# EAGLE design mailbox (EAGLE 7.5.0)
CNAME: MiniElektro Denmark; CREVISION: 0 #1620; DESIGNER: By: NWYKE
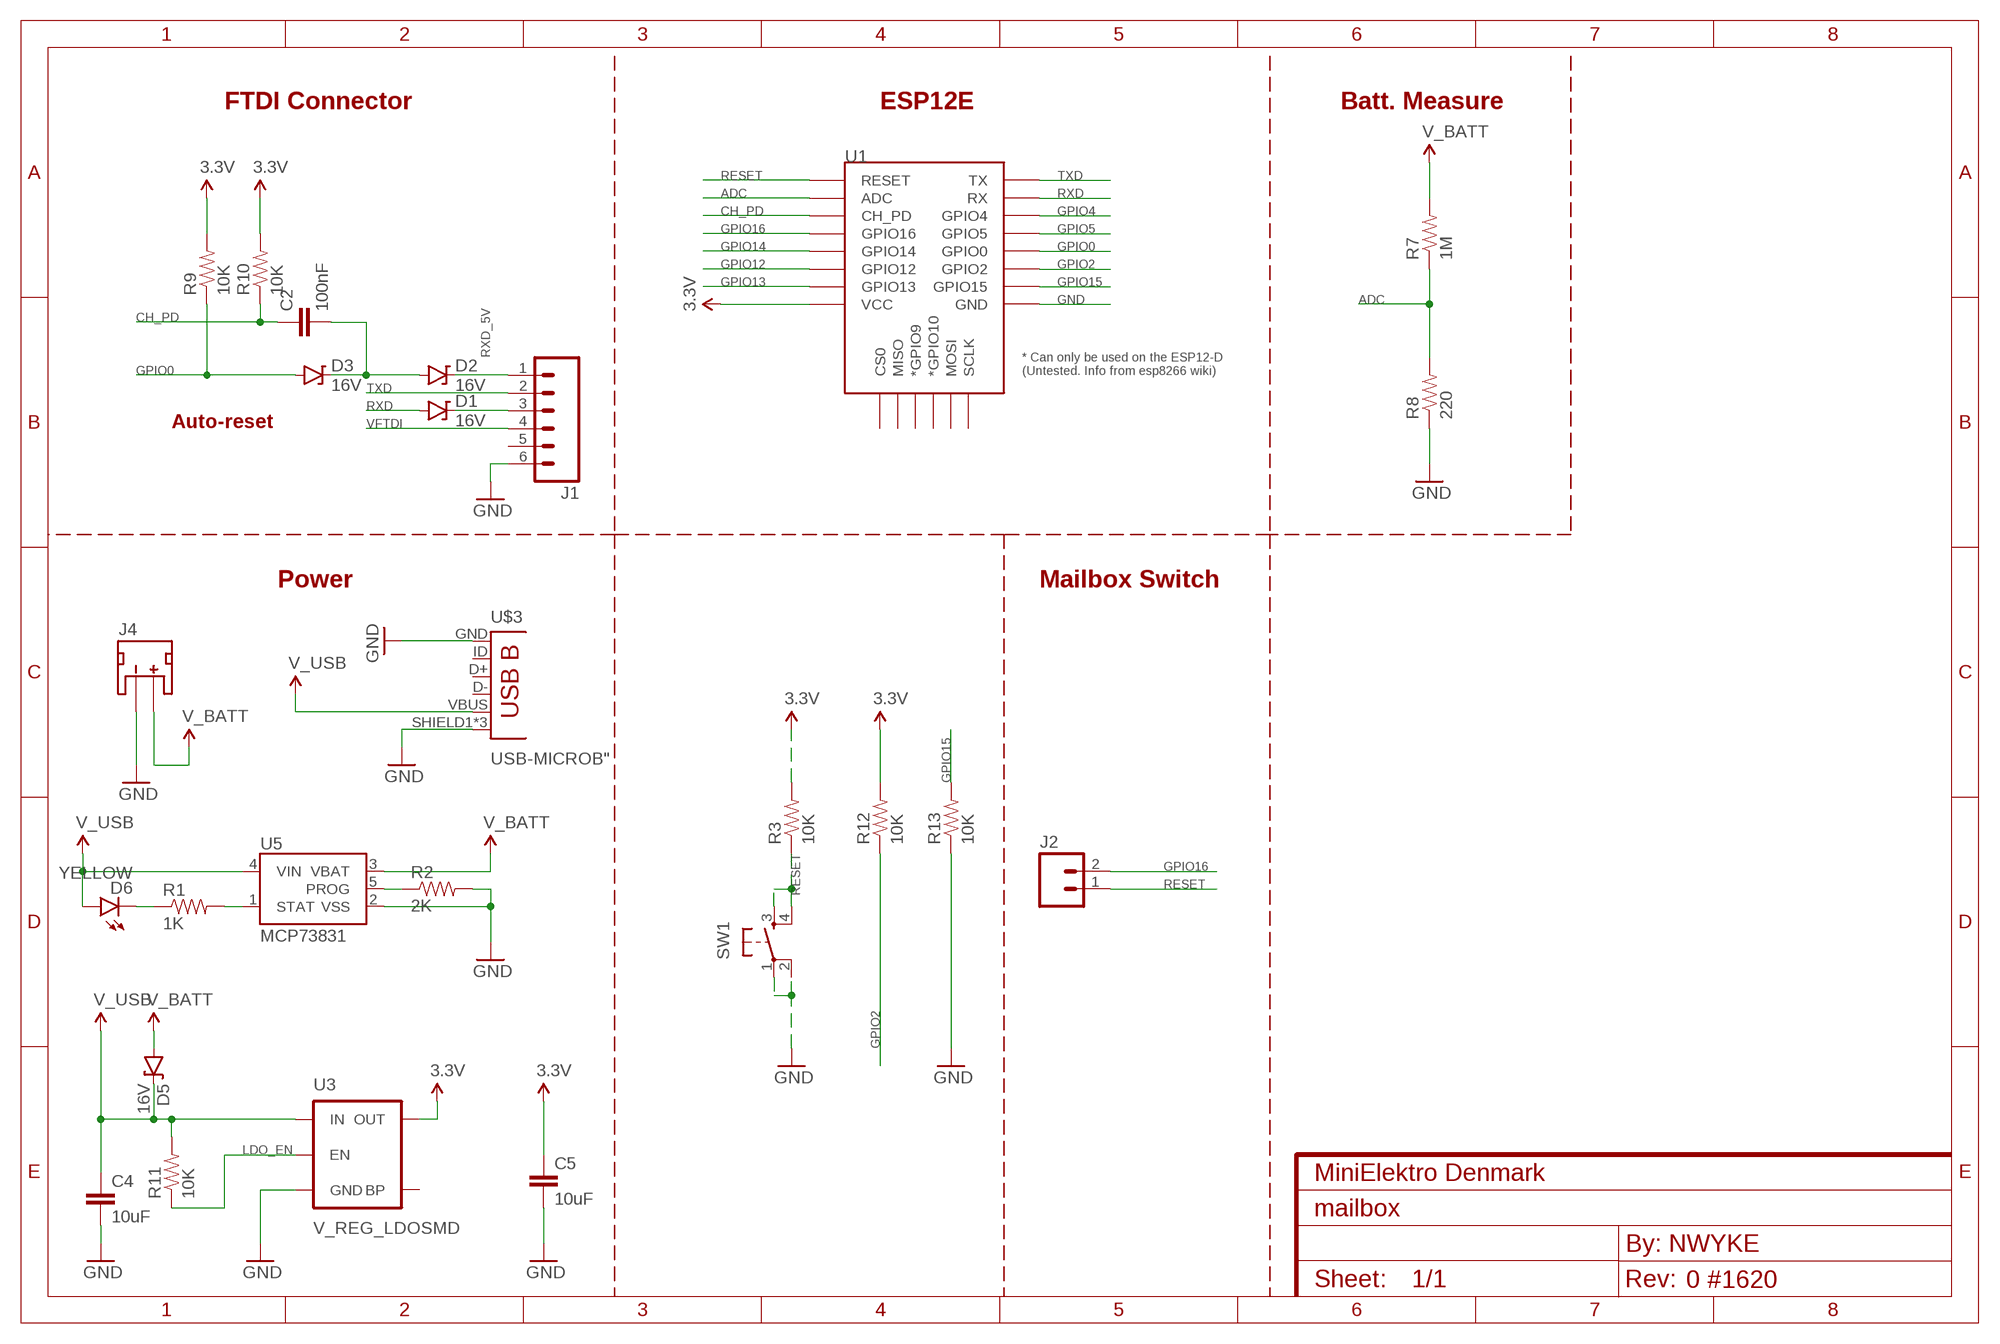
[diagram p0: schematic, sheet 1]

## Parts
C2  100nF  CAP1206  [1206]
C4  10uF  CAP1206  [1206]
C5  10uF  CAP1206  [1206]
D1  16V  DIODE-ZENER16V  [SOD-123]
D2  16V  DIODE-ZENER16V  [SOD-123]
D3  16V  DIODE-ZENER16V  [SOD-123]
D5  16V  DIODE-ZENER16V  [SOD-123]
D6  YELLOW  LED-YELLOW1206  [LED-1206]
J1  M06SILK_FEMALE_PTH  [1X06]
J2  M02LOCK  [1X02_LOCK]
J4  JST_2MM_MALE  [JST-2-SMD]
R1  1K  RESISTOR1206  [1206]
R2  2K  RESISTOR1206  [1206]
R3  10K  RESISTOR1206  [1206]
R7  1M  RESISTOR1206  [1206]
R8  220  RESISTOR1206  [1206]
R9  10K  RESISTOR1206  [1206]
R10  10K  RESISTOR1206  [1206]
R11  10K  RESISTOR1206  [1206]
R12  10K  RESISTOR1206  [1206]
R13  10K  RESISTOR1206  [1206]
SW1  SWITCH_SPST_4_PINRECT  [TACTILE_SWITCH_SMD_4.6X2.8MM]
U1  ESP12ESMD  [ESP12E-SMD]
U3  V_REG_LDOSMD  [SOT23-5]
U5  MCP73831  [SOT23-5]
U$3  USB-MICROB"  [USB-B-MICRO-SMD_V03]

## Nets
3.3V: C5.1 R3.2 R9.2 R10.2 R12.2 U1.VCC U3.5(OUT)
ADC: R7.1 R8.2 U1.ADC
CH_PD: C2.1 R10.1 U1.CH_PD
GND: C4.2 C5.2 J1.6 J4.1(-) R2.2 R8.1 R13.1 SW1.1 SW1.2 U1.GND U3.2(GND) U5.2(VSS) U$3.GND U$3.SHIELD1(SHIELD) U$3.SHIELD2(SHIELD) U$3.SHIELD3(SHIELD)
GPIO0: D3.A R9.1 U1.GPIO0
GPIO2: R12.1 U1.GPIO2
GPIO4: U1.GPIO4
GPIO5: U1.GPIO5
GPIO12: U1.GPIO12
GPIO13: U1.GPIO13
GPIO14: U1.GPIO14
GPIO15: R13.2 U1.GPIO15
GPIO16: J2.2 U1.GPIO16
LDO_EN: R11.1 U3.3(EN)
N$1: D6.C R1.1
N$2: D2.C J1.1
N$3: C2.2 D2.A D3.C
N$6: R1.2 U5.1(STAT)
N$7: R2.1 U5.5(PROG)
RESET: J2.1 R3.1 SW1.3 SW1.4 U1.RESET
RXD: D1.A U1.RXD0(RX)
RXD_5V: D1.C J1.3
TXD: J1.2 U1.TXD0(TX)
V_BATT: D5.A J4.2(+) R7.2 U5.3(VBAT)
V_USB: C4.1 D5.C D6.A R11.2 U3.1(IN) U5.4(VIN) U$3.VBUS
VFTDI: J1.4
Unconnected: J1.5 J4.NC1(PAD1) J4.NC2(PAD2) U1.CS0 U1.GPIO9(*GPIO9) U1.GPIO10(*GPIO10) U1.MISO U1.MOSI U1.SCLK U3.4(BP) U$3.D+ U$3.D- U$3.ID(USBID)

## Notes on the sheet
- FTDI Connector | ESP12E | Batt. Measure
- Auto-reset
- Power | Mailbox Switch

## Library data of the parts
C2 C4 C5 = SparkFun-Passives:CAP: Capacitor Standard 0603 ceramic capacitor, and 0.1" leaded capacitor.
D1-D3 D5 = SparkFun-DiscreteSemi:DIODE-ZENER: Zener Diode Production Part - 8199 3.4V Zener Voltage; PROD_ID: DIO-12440
D6 = SparkFun-LED:LED-YELLOW: Yellow SMD LEDs LilyPad 1206- DIO-09909 0603- DIO-09003 "SMART" means more efficient and expensive; PROD_ID: DIO-00820
J1 = SparkFun-Connectors:M06: Header 6 Standard 6-pin 0.1" header. Use with straight break away headers (SKU : PRT-00116), right angle break away headers (PRT-00553), swiss pins (PRT-00743), machine pins (PRT-00117), and female headers (PRT-00115). Molex polarized connector foot print use with SKU : PRT-08094 with associated crimp pins and housings. NOTES ON THE VARIANTS LOCK and LOCK_LONGPADS... This footprint was designed to help hold the alignment of a through-hole component (i.e. 6-pin header) while soldering it into place. You may notice that each hole has been shifted either up or down by 0.005 of an inch from it's more standard position (which is a perfectly straight line). This slight alteration caused the pins (the squares in the middle) to touch the edges of the holes. Because they are alternating, it causes a "brace" to hold the component in place. 0.005 has proven to be the perfect amount of "off-center" position when using our standard breakaway headers. Although looks a little odd when you look at the bare footprint, once you have a header in there, the alteration is very hard to notice. Also,if you push a header all the way into place, it is covered up entirely on the bottom side. This idea of altering the position of holes to aid alignment will be further integrated into the Sparkfun Library for other footprints. It can help hold any component with 3 or more connection pins.; PROD_ID: CONN-08437
J2 = SparkFun-Connectors:M02: Standard 2-pin 0.1" header. Use with - straight break away headers ( PRT-00116) - right angle break away headers (PRT-00553) - swiss pins (PRT-00743) - machine pins (PRT-00117) - female headers (PRT-00115) Molex polarized connector foot print use with: PRT-08233 with associated crimp pins and housings. 2.54_SCREWTERM for use with PRT-10571. 3.5mm Screw Terminal footprints for PRT-08084 5mm Screw Terminal footprints for use with PRT-08432
J4 = SparkFun-Connectors:JST_2MM_MALE: Mates to single-cell LiPo batteries. CONN-11443 Now with smashable polarity marks!; BTM_NEG: -; BTM_POS: +; PROD_ID: CONN-11443; TOP_NEG: -; TOP_POS: +
R1-R3 R7-R13 = SparkFun-Passives:RESISTOR: Resistor Basic schematic elements and footprints for 0603, 1206, and PTH resistors.
SW1 = SparkFun-Electromechanical:SWITCH_SPST_4_PIN; PROD_ID: SWCH-13065
U1 = esp8266modules:ESP12E: ESP12E Module
U3 = SparkFun-PowerIC:V_REG_LDO: Voltage Regulator LDO Standard 150mA LDO voltage regulator in SOT-23 layout. Micrel part MIC5205. BP (by-pass) pin is used to lower output noise with 470pF cap.
U5 = SparkFun-PowerIC:MCP73831: Miniature single cell, fully integrated Li-Ion, Li-polymer charge management controller http://ww1.microchip.com/downloads/en/DeviceDoc/20001984g.pdf IC-09995; PROD_ID: IC-09995
U$3 = SparkFun-Connectors:USB-MICROB; PROD_ID: CONN-11752

## Board
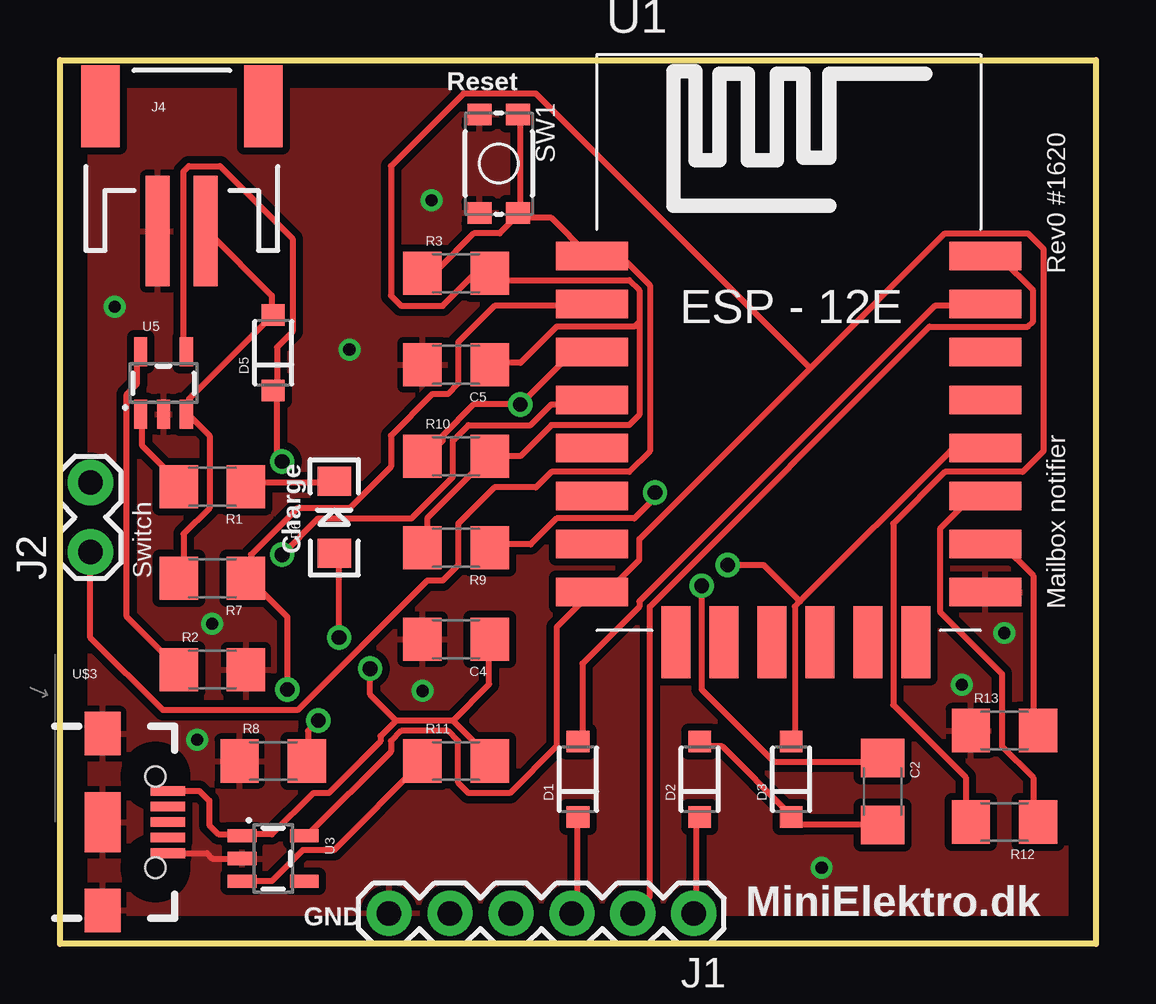
[diagram p1: board, top side]
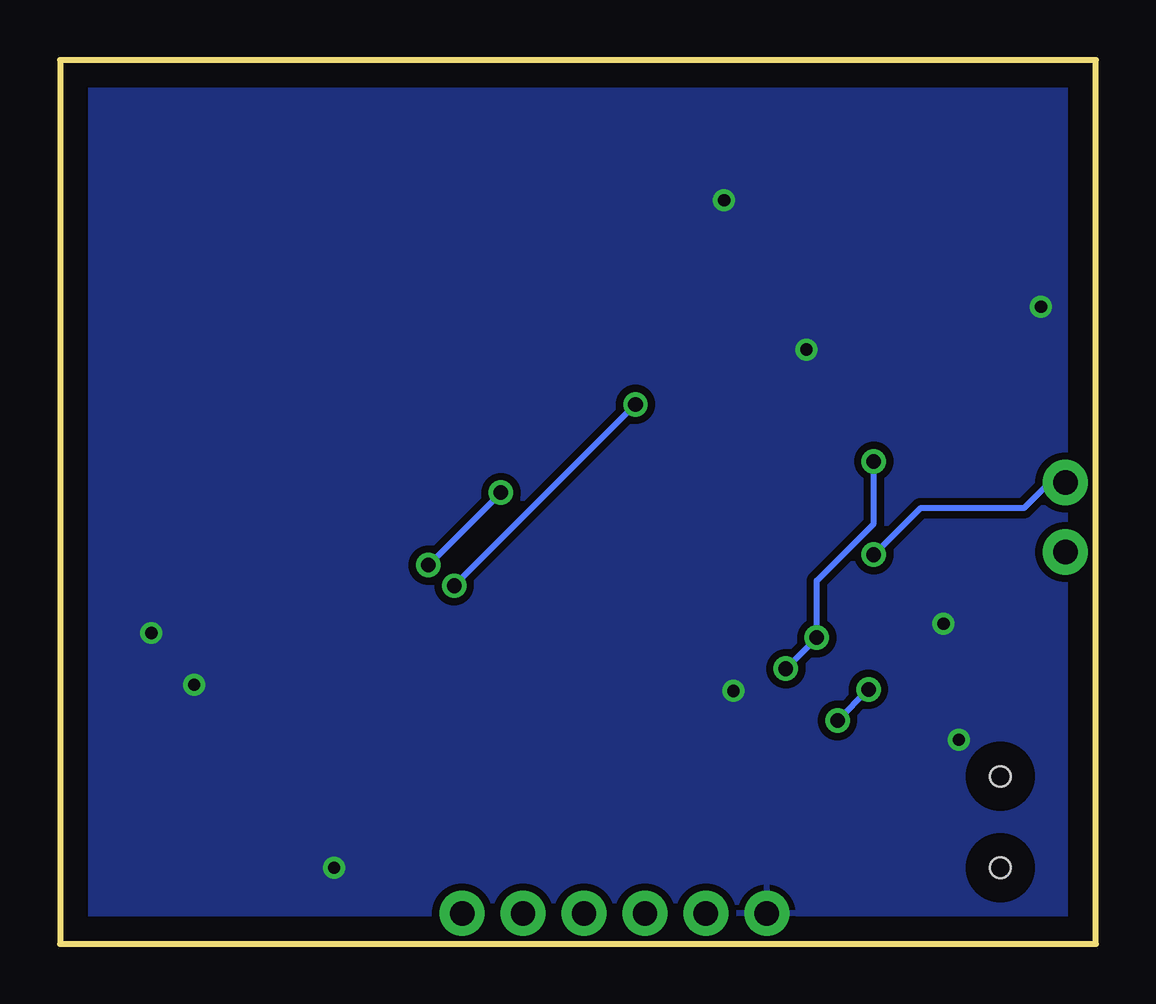
[diagram p2: board, bottom side, seen from below]

Size 43.18 x 36.83 mm. Coordinates in mm from the lower left corner, seen from the top.
Outline: 0,0 0,36.83 43.18,36.83 43.18,0 0,0
Copper layers (1*16): Top 0.035mm / dielectric 1.5mm / Bottom 0.035mm
Design rules "default *": minimum track width 10mil, minimum drill 24mil, track to track 7mil, track to pad 7mil, pad to pad 7mil, via to via 7mil, smd to smd 7mil, copper to edge 40mil, drill to drill 8mil, minimum pad ring 10mil, minimum via ring 8mil, stop-mask expansion 4mil, vias tented up to drill 0mil, thermal gap 10mil

### Footprints (pad centres in the part's own frame; a part is rotated, then mirrored left to right if it is on the bottom)
1206 = smd 1.6 x 1.8: 1 -1.4,0; 2 1.4,0
SOD-123 = smd 0.9 x 0.95: A 1.575,0; C -1.575,0
LED-1206 = smd 1.2 x 1.4: A -1.5,0; C 1.5,0
1X06 = drill 1.016 pad 1.88: 1 0,0; 2 2.54,0; 3 5.08,0; 4 7.62,0; 5 10.16,0; 6 12.7,0
1X02_LOCK = drill 1.016 pad 1.88: 1 -0.178,0; 2 2.718,0
JST-2-SMD = smd 1 x 4.6: 1 -1,-3.7; 2 1,-3.7 | smd 1.6 x 3.4: NC1 -3.4,1.5; NC2 3.4,1.5
TACTILE_SWITCH_SMD_4.6X2.8MM = smd 0.9 x 1: 1 -2.05,-0.8; 2 2.05,-0.8; 3 2.05,0.8; 4 -2.05,0.8
ESP12E-SMD = smd 3 x 1.2: ADC -8.3,3.8; CH_PD -8.3,1.8; GND 8.1,-8.2; GPIO0 8.1,-2.2; GPIO2 8.1,-4.2; GPIO4 8.1,1.8; GPIO5 8.1,-0.2; GPIO12 -8.3,-4.2; GPIO13 -8.3,-6.2; GPIO14 -8.3,-2.2; GPIO15 8.1,-6.2; GPIO16 -8.3,-0.2; RESET -8.3,5.8; RXD0 8.1,3.8; TXD0 8.1,5.8; VCC -8.3,-8.2 | smd 1.2 x 3: CS0 -4.8,-10.3; GPIO9 -0.8,-10.3; GPIO10 1.2,-10.3; MISO -2.8,-10.3; MOSI 3.2,-10.3; SCLK 5.2,-10.3
SOT23-5 = smd 0.55 x 1.2: 1 -0.95,-1.3; 2 0,-1.3; 3 0.95,-1.3; 4 0.95,1.3; 5 -0.95,1.3
USB-B-MICRO-SMD_V03 = smd 1.45 x 0.4: D+ 2.725,0; D- 2.725,0.65; GND 2.725,-1.3; ID 2.725,-0.65; VBUS 2.725,1.3 | smd 1.5 x 1.8: SHIELD1 0,3.685; SHIELD2 0,-3.685 | smd 1.5 x 2.5: SHIELD3 0,0 | hole 0.85: 2.2,1.9; 2.2,-1.9

### Placement (x,y rotation side)
C2  34.29,6.35 270 top
C4  16.51,12.7 180 top
C5  16.51,24.13 180 top
D1  21.59,6.86 90 top
D2  26.67,6.86 90 top
D3  30.48,6.86 90 top
D5  8.89,24.64 90 top
D6  11.43,17.78 90 top
J1  26.42,1.27 180 top
J2  1.27,16.51 90 top
J4  5.08,33.4 0 top
R1  6.35,19.05 180 top
R2  6.35,11.43 0 top
R3  16.51,27.94 0 top
R7  6.35,15.24 180 top
R8  8.89,7.62 0 top
R9  16.51,16.51 180 top
R10  16.51,20.32 0 top
R11  16.51,7.62 0 top
R12  39.37,5.08 180 top
R13  39.37,8.89 0 top
SW1  18.29,32.51 270 top
U1  30.48,22.86 0 top
U3  8.89,3.56 270 top
U5  4.32,23.37 0 top
U$3  1.78,5.08 0 top

### Tracks (layer width: path | path; a pad name or v marks a point on that pad's centre or on a via)
3.3V
  Top 0.254: R9.2 15.3,16.65 15.3,17.73 17.89,20.32 R10.2 19.19,20.32 20.48,21.62 23.72,21.62 24.16,22.05 24.16,25.93 | 24.16,25.93 23.94,25.72 20.7,25.72 19.19,24.21 18.11,24.21 C5.1 | 24.16,25.93 24.16,27.23 23.72,27.66 18.33,27.66 18.11,27.88 R3.2 17.89,27.88 17.25,27.88 15.95,26.58 14.22,26.58 13.79,27.01 13.79,32.41 16.82,35.43 19.84,35.43 31.28,23.99 | U3.5 10.34,4.56 13.79,8.01 13.79,8.45 14.22,8.88 16.17,8.88 16.6,8.45 16.6,6.72 17.03,6.29 18.76,6.29 20.7,8.23 20.7,13.2 22,14.49 U1.VCC 22.21,14.71 22.86,14.71 24.16,16 24.16,16.87 31.28,23.99 | 31.28,23.99 36.89,29.6 40.35,29.6 41,28.96 41,20.54 40.13,19.67 36.89,19.67 34.74,17.51 34.74,9.96 37.76,6.93 37.76,5.21 R12.2
ADC  (via drill 0.61)
  Top 0.254: U1.ADC 22,26.58 18.11,26.58 16.6,25.07 16.6,23.34 16.17,22.91 15.52,22.91 13.79,21.18 13.79,19.89 12.06,18.16 9.91,18.16 7.96,16.22 7.96,15.35 R7.1 7.96,15.14 9.47,13.63 v9.47,10.6 | v10.77,9.31 10.34,8.88 10.34,7.8 R8.2
  Bottom 0.254: v9.47,10.6 v10.77,9.31
CH_PD  (via drill 0.61)
  Top 0.254: v26.75,14.92 26.75,10.6 29.77,7.58 34.09,7.58 C2.1 | U1.CH_PD 22,24.64 21.35,24.64 v19.19,22.48 17.25,22.48 15.95,21.18 15.95,20.97 15.3,20.32 R10.1
  Bottom 0.254: v19.19,22.48 v26.75,14.92
GND  (via drill 0.51)
  Top 0.254: U$3.GND 6.13,3.78 6.35,3.56 U3.2
  other vias: 31.75,3.18 37.59,10.79 39.37,12.95 5.71,8.51 6.35,13.34 2.29,26.54 15.11,10.54 12.06,24.77 15.49,30.99
  pour Bottom (isolate 0.305): 0,36.83 0,0 43.18,0 43.18,36.83
  pour Top (isolate 0.305): 0,36.83 0,0 43.18,0 43.18,36.83
GPIO0  (via drill 0.61)
  Top 0.254: 30.85,14.28 37.11,20.54 38.41,20.54 U1.GPIO0 | 30.85,14.28 30.63,14.06 30.63,8.45 D3.A | v24.8,18.81 24.8,18.59 23.94,17.73 20.7,17.73 19.62,16.65 18.11,16.65 R9.1 | v27.83,15.79 29.34,15.79 30.85,14.28
  Bottom 0.254: v27.83,15.79 v24.8,18.81
GPIO2
  Top 0.254: R12.1 40.56,5.21 40.56,6.93 39.27,8.23 39.27,11.25 36.68,13.84 36.68,17.3 37.97,18.59 38.41,18.59 U1.GPIO2
GPIO15
  Top 0.254: R13.2 40.56,9.09 40.56,15.35 39.27,16.65 38.62,16.65 U1.GPIO15
GPIO16  (via drill 0.61)
  Top 0.254: v9.26,16.22 10.77,17.73 14.66,17.73 16.38,19.46 16.38,20.97 17.03,21.62 19.62,21.62 20.48,22.48 22,22.48 U1.GPIO16
  Bottom 0.254: v9.26,16.22 7.31,18.16 3,18.16 2.13,19.03 1.27,19.03 J2.2
LDO_EN
  Top 0.254: U3.3 7.75,2.62 8.83,2.62 10.12,3.91 11.42,3.91 15.09,7.58 R11.1
N$1
  Top 0.254: D6.C 11.42,19.24 7.96,19.24 R1.1
N$2
  Top 0.254: D2.C 26.53,5.21 26.53,1.32 J1.1
N$3
  Top 0.254: D2.A 26.75,8.23 27.61,8.23 30.42,5.42 D3.C 30.63,5.21 30.85,4.99 34.09,4.99 C2.2
N$6
  Top 0.254: U5.1 3.43,22.05 3.43,20.75 4.94,19.24 R1.2
N$7
  Top 0.254: U5.5 3.21,24.64 3.21,23.34 2.78,22.91 2.78,13.63 4.94,11.47 R2.1
RESET
  Top 0.254: SW1.3 19.19,30.25 20.48,30.25 22,28.74 U1.RESET 22.21,28.52 23.51,28.52 24.59,27.45 24.59,20.54 23.72,19.67 20.48,19.67 19.84,19.03 18.11,19.03 16.6,17.51 16.6,15.79 15.95,15.14 15.3,15.14 9.91,9.74 4.29,9.74 1.27,12.76 J2.1 | SW1.4 19.19,34.35 19.19,30.47 SW1.3 | R3.1 15.3,28.09 15.73,28.09 17.25,29.6 18.33,29.6 18.97,30.25 SW1.3
RXD
  Top 0.254: D1.A 21.78,8.45 21.78,11.68 24.16,14.06 24.16,14.28 36.46,26.58 38.41,26.58 U1.RXD0
RXD_5V
  Top 0.254: D1.C 21.57,5.21 21.57,1.54 21.35,1.32 J1.3
TXD
  Top 0.254: U1.TXD0 38.62,28.52 39.27,28.52 40.56,27.23 40.56,25.93 40.35,25.72 36.25,25.72 24.59,14.06 24.59,1.97 23.94,1.32 J1.2
V_BATT
  Top 0.254: J4.2 6.24,29.6 8.83,27.01 8.83,26.37 D5.A 8.83,26.15 5.37,22.7 5.37,22.26 U5.3 5.37,22.05 6.24,21.18 6.24,18.16 5.16,17.08 5.16,15.35 R7.2
V_USB  (via drill 0.61)
  Top 0.254: U5.4 5.16,24.85 5.16,32.2 5.37,32.41 6.67,32.41 9.69,29.39 9.69,25.5 9.04,24.85 9.04,23.13 D5.C 9.04,22.91 9.04,20.32 v9.26,20.1 | 14.01,9.31 13.36,8.66 13.36,8.45 11.2,6.29 10.55,6.29 8.83,4.56 7.75,4.56 U3.1 7.52,4.57 6.6,4.57 6.22,4.95 6.22,5.97 5.81,6.38 U$3.VBUS | 16.38,9.31 14.01,9.31 | 16.38,9.31 17.89,7.8 R11.2 | v11.63,12.76 11.63,16.22 D6.A | v12.93,11.47 12.93,10.39 14.01,9.31 | 16.38,9.31 17.89,10.82 17.89,12.55 C4.1
  Bottom 0.254: v12.93,11.47 v11.63,12.76 11.63,15.14 9.26,17.51 v9.26,20.1

### Text on the board
tPlace: Reset | Rev0 #1620 | Charge | Switch | Mailbox notifier | GND | MiniElektro.dk